# Altium schematic sheet DC-DC_BUCK-BOOST.SchDoc
size 1399 x 900 mm; SheetNumber: 1; SheetTotal: 1; SPICEModelCachePRJWMUZL: <root> / <DocumentId>PRJWMUZL</DocumentId> / <CacheFrame Number="0"> / <Model Name="7850_74477530_1m" Kind="CKT"> / <Text>******* / .subckt 7850_74477530_1m 1 2 / Rp 1 2 187304.915771 / Cp 1 2 4.36976277949p / Rs 1 N3 3.3 / L1 N3 2 1000u / .ends 7850_74477530_1m</Text> / </Model> / </CacheFrame> / </root>
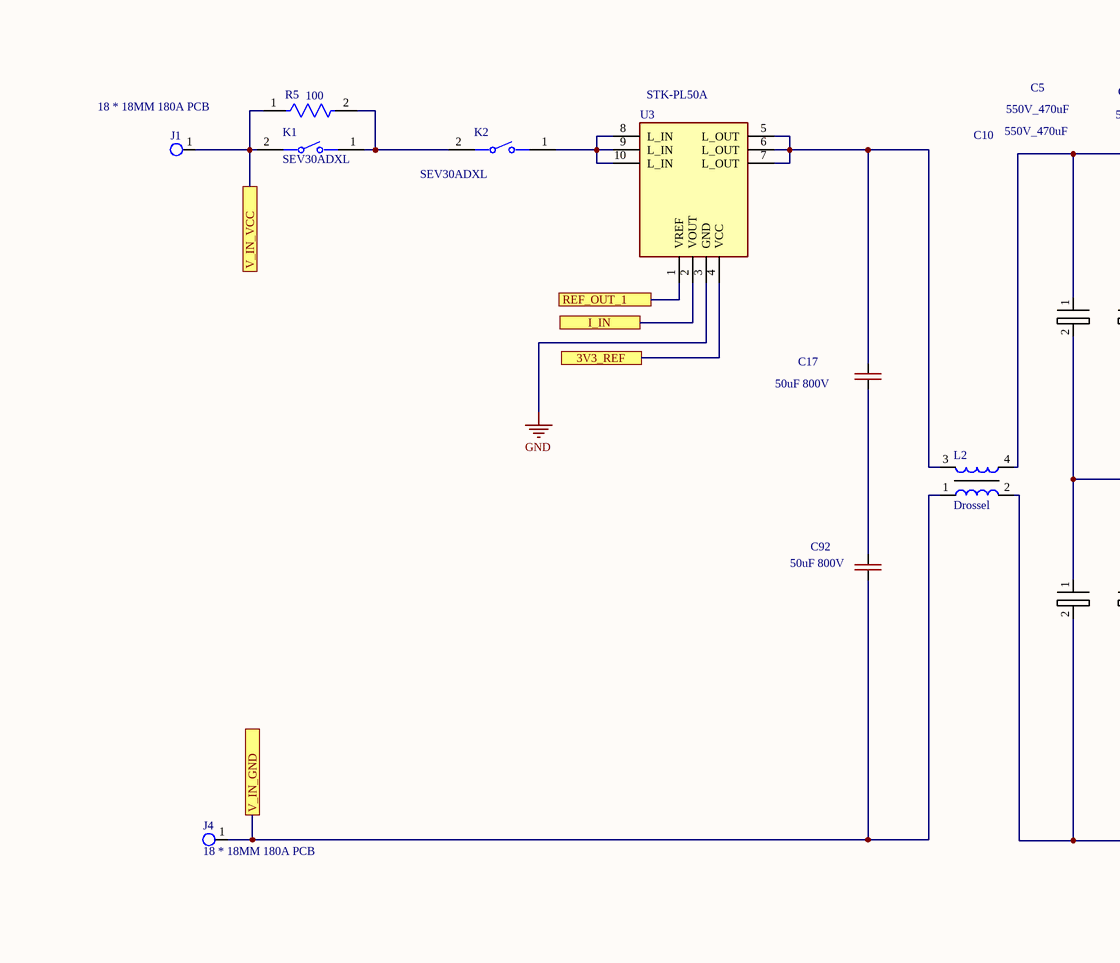
[diagram p0: DC-DC_BUCK-BOOST.SchDoc, top column 1 of 4]
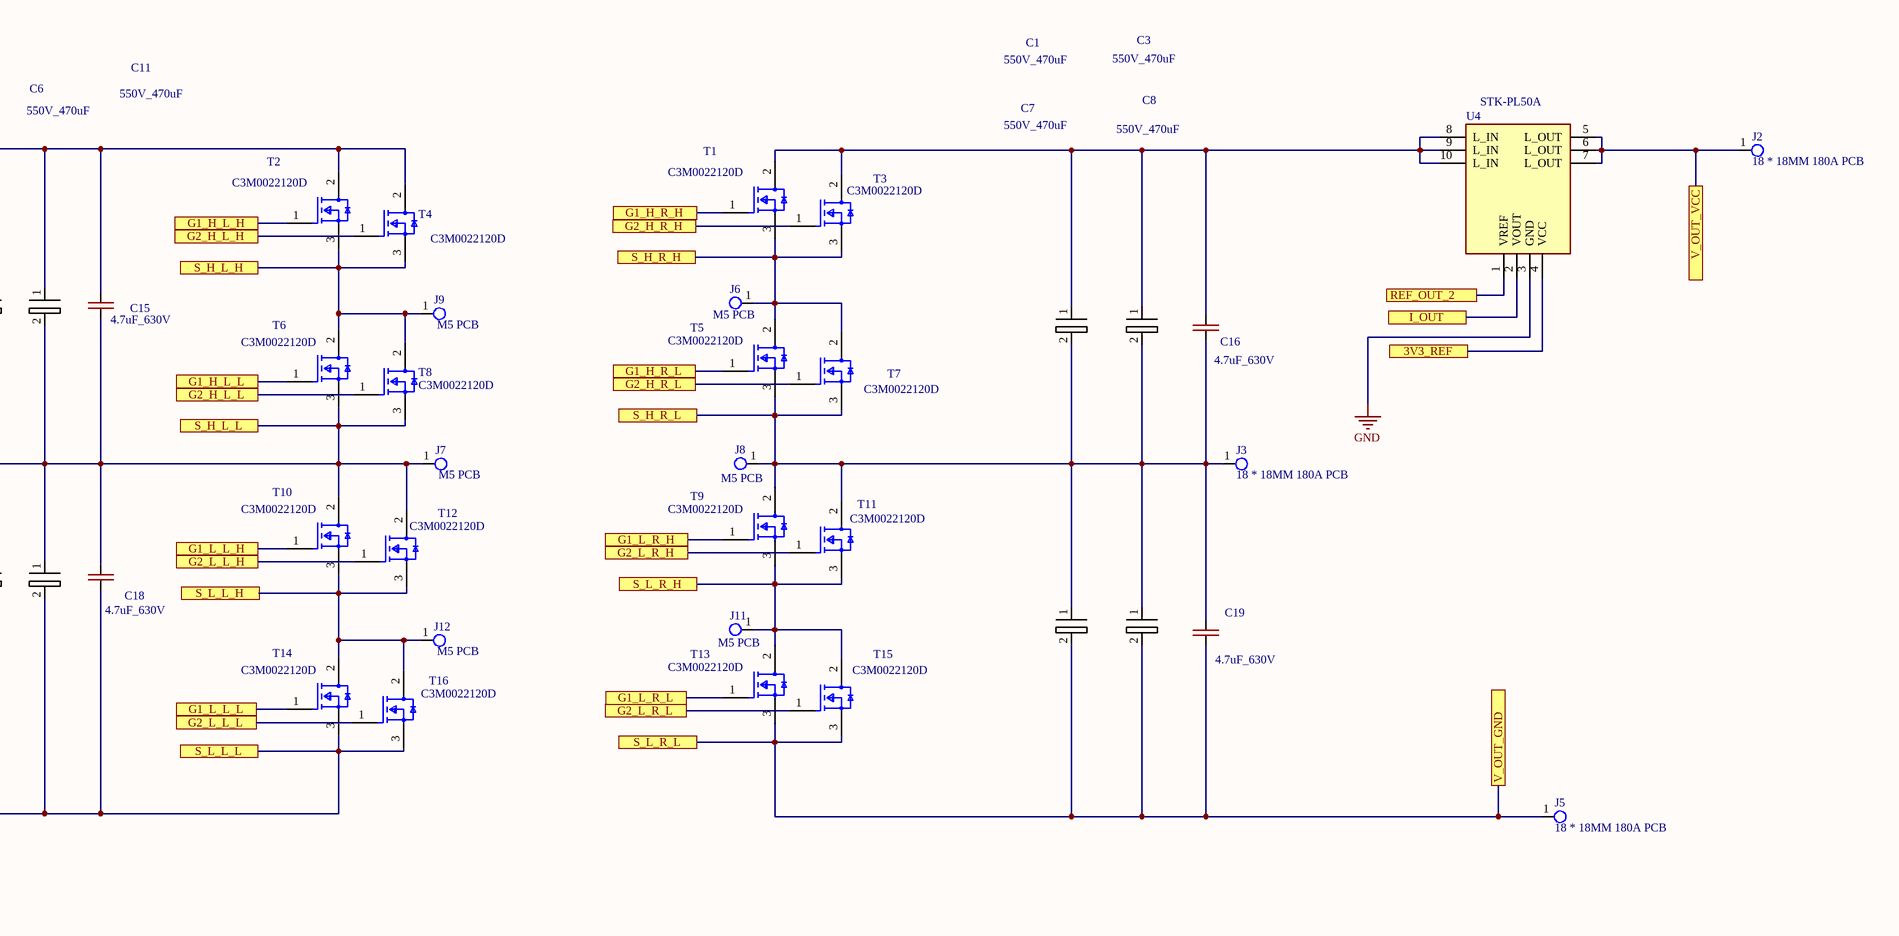
[diagram p1: DC-DC_BUCK-BOOST.SchDoc, top column 2 of 4]
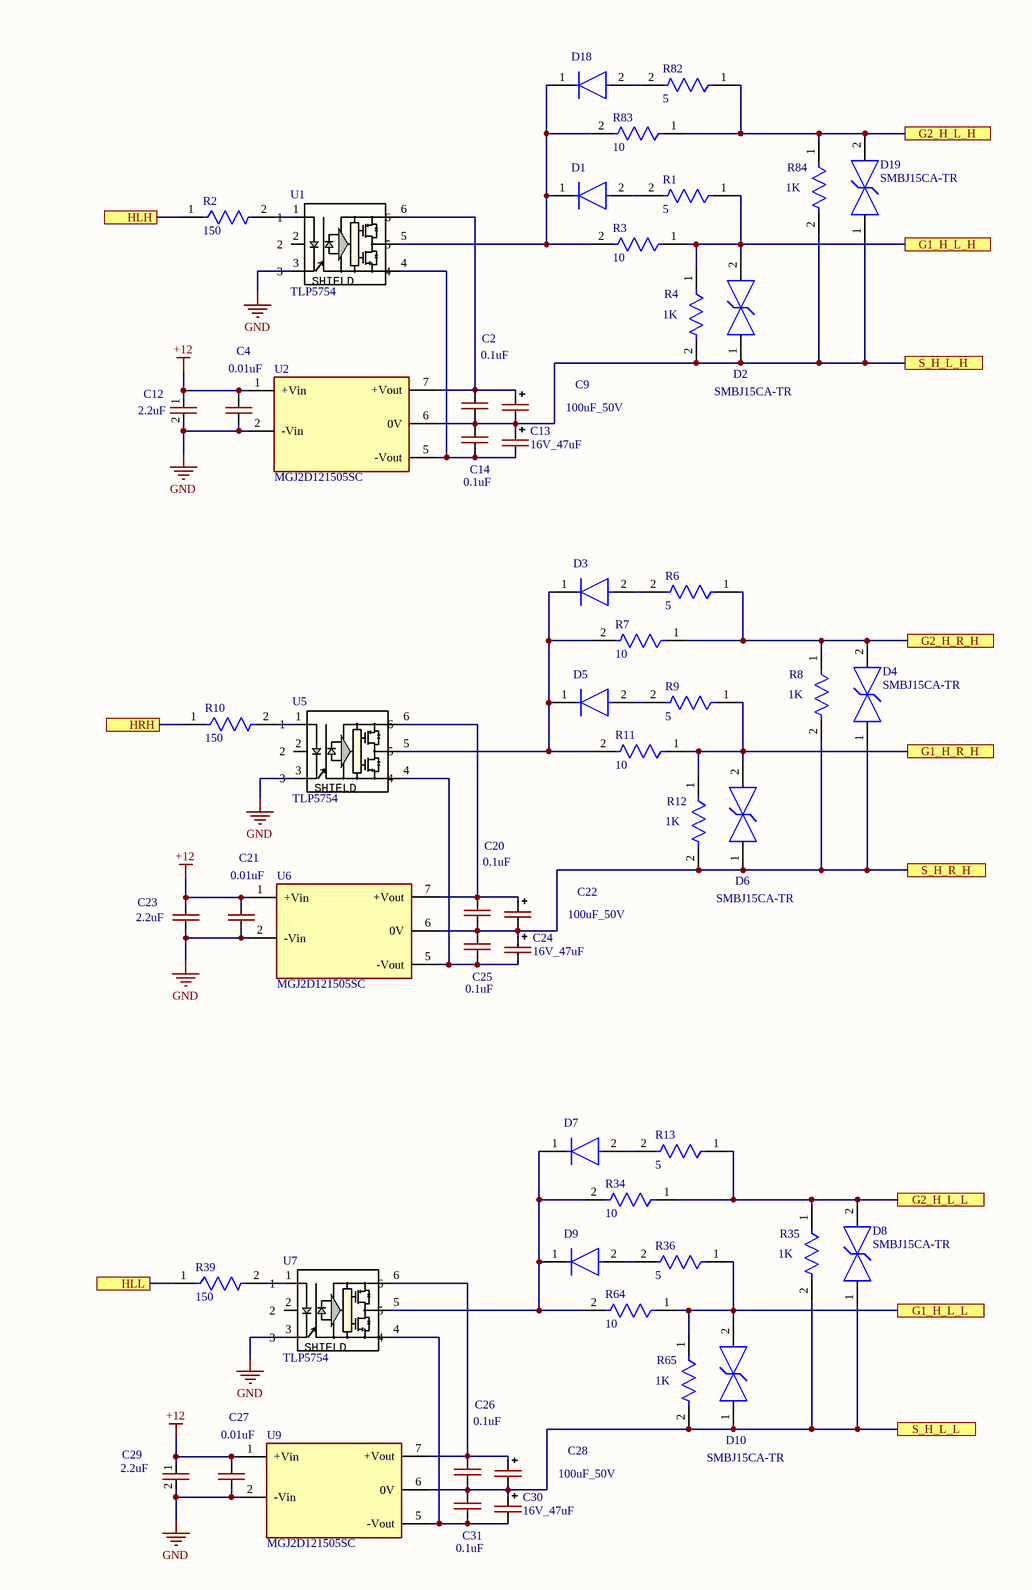
[diagram p2: DC-DC_BUCK-BOOST.SchDoc, top column 4 of 4]
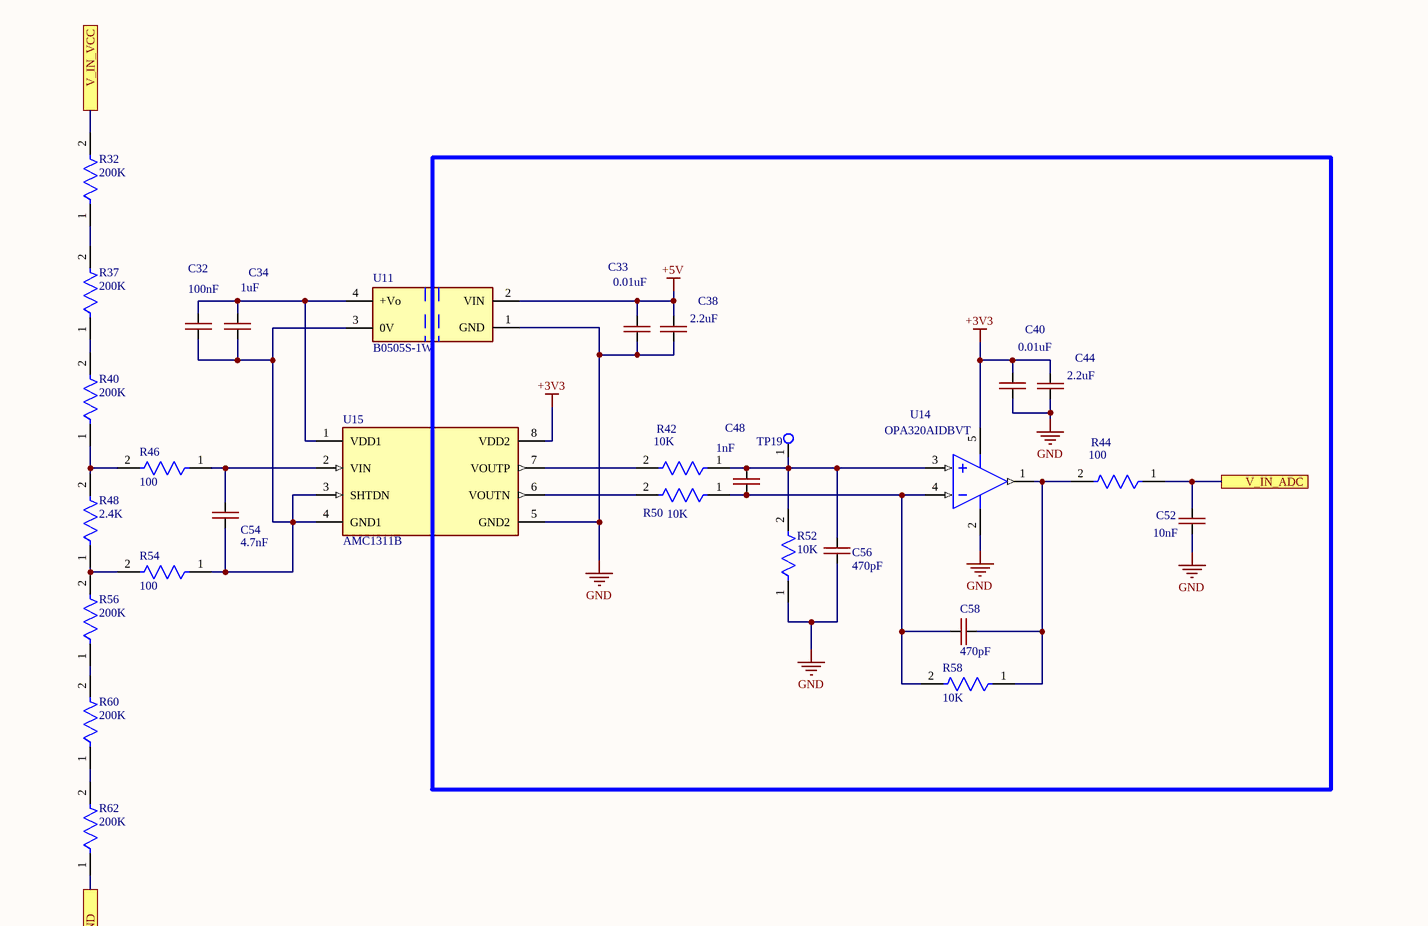
[diagram p3: DC-DC_BUCK-BOOST.SchDoc, centre column 1 of 4]
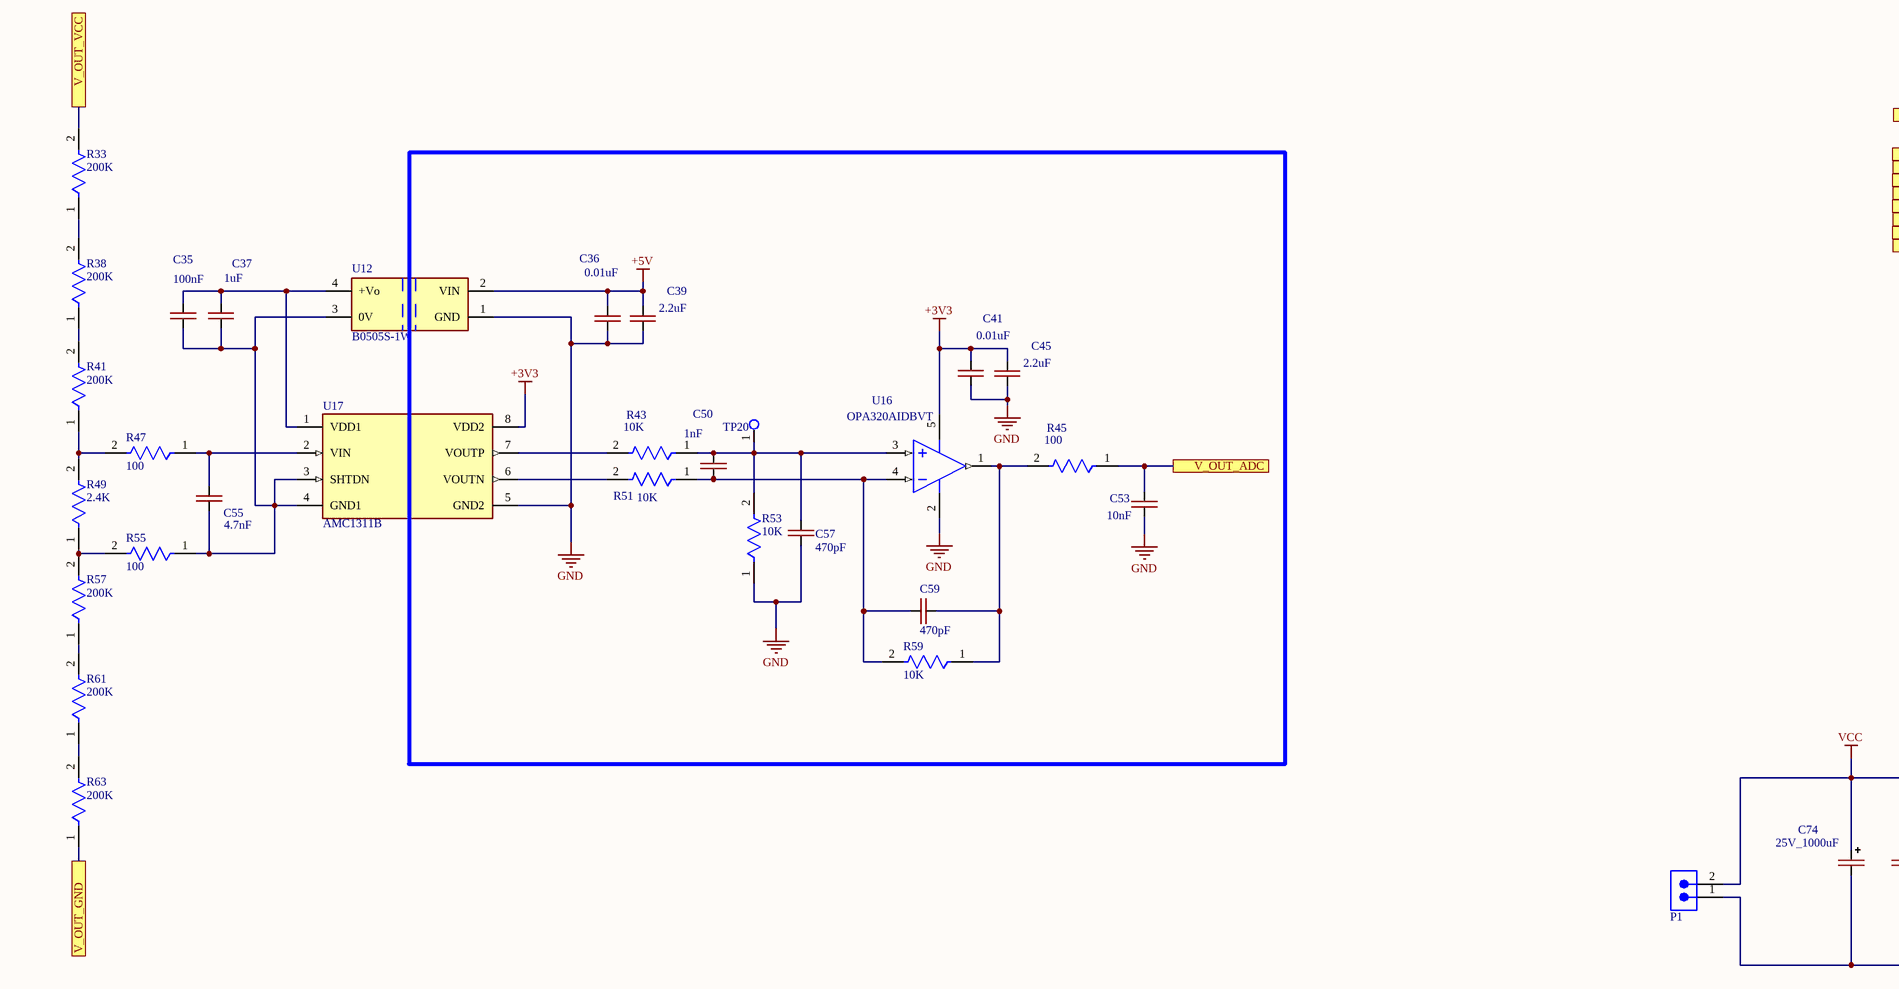
[diagram p4: DC-DC_BUCK-BOOST.SchDoc, centre column 2 of 4]
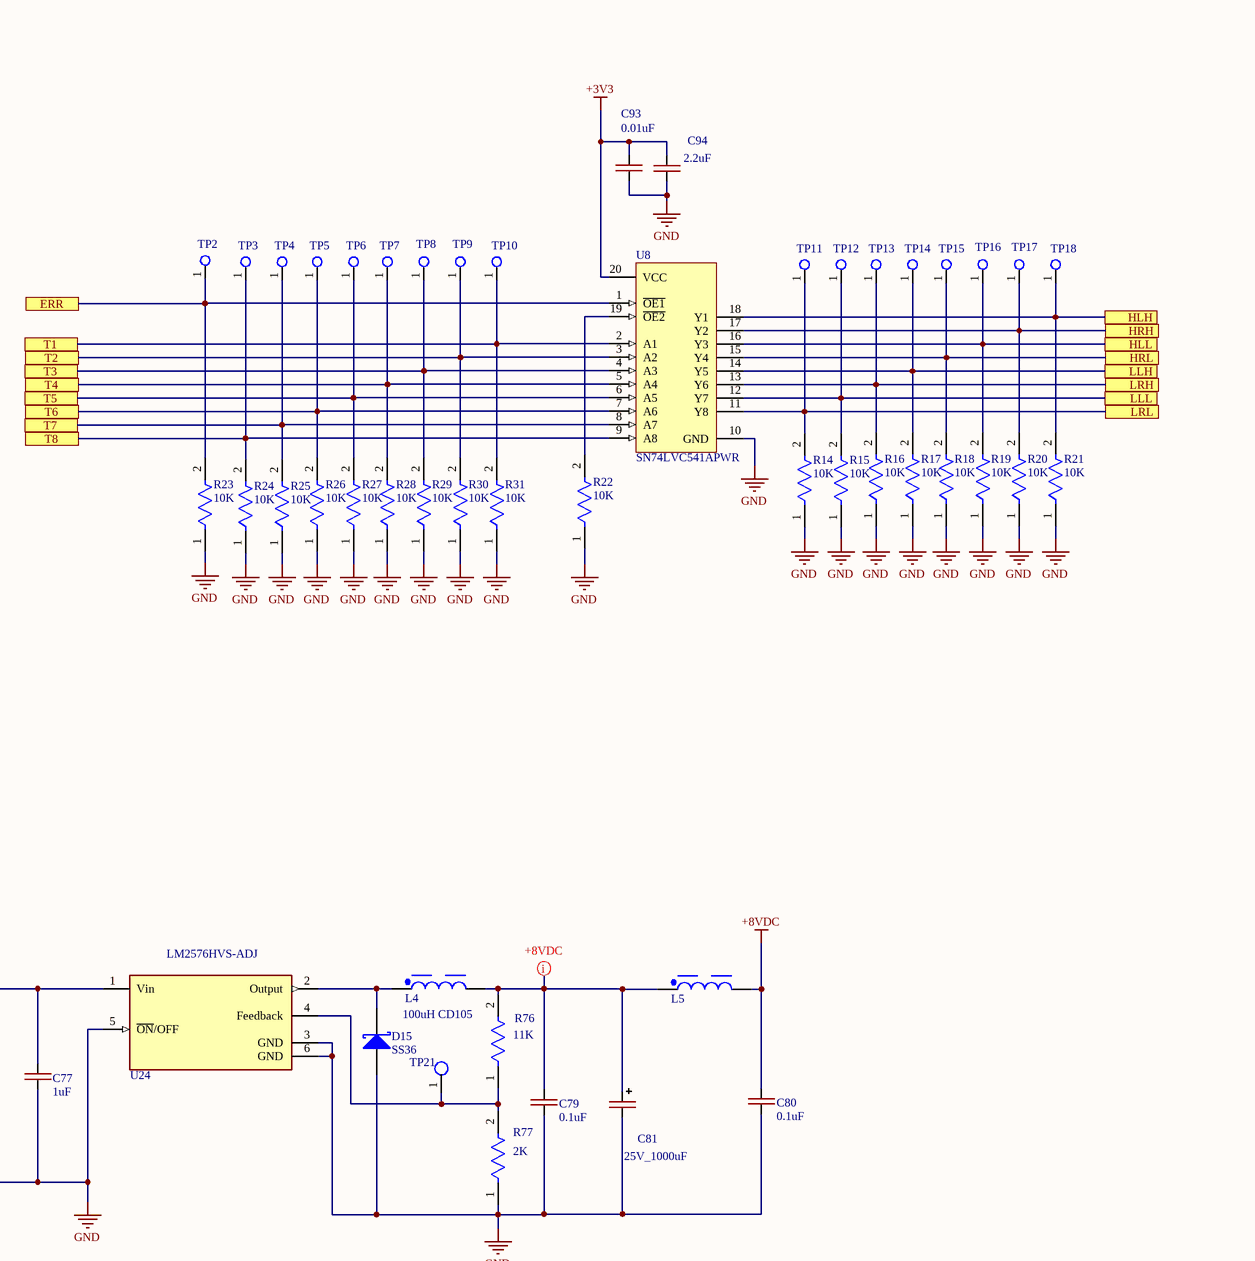
[diagram p5: DC-DC_BUCK-BOOST.SchDoc, centre column 3 of 4]
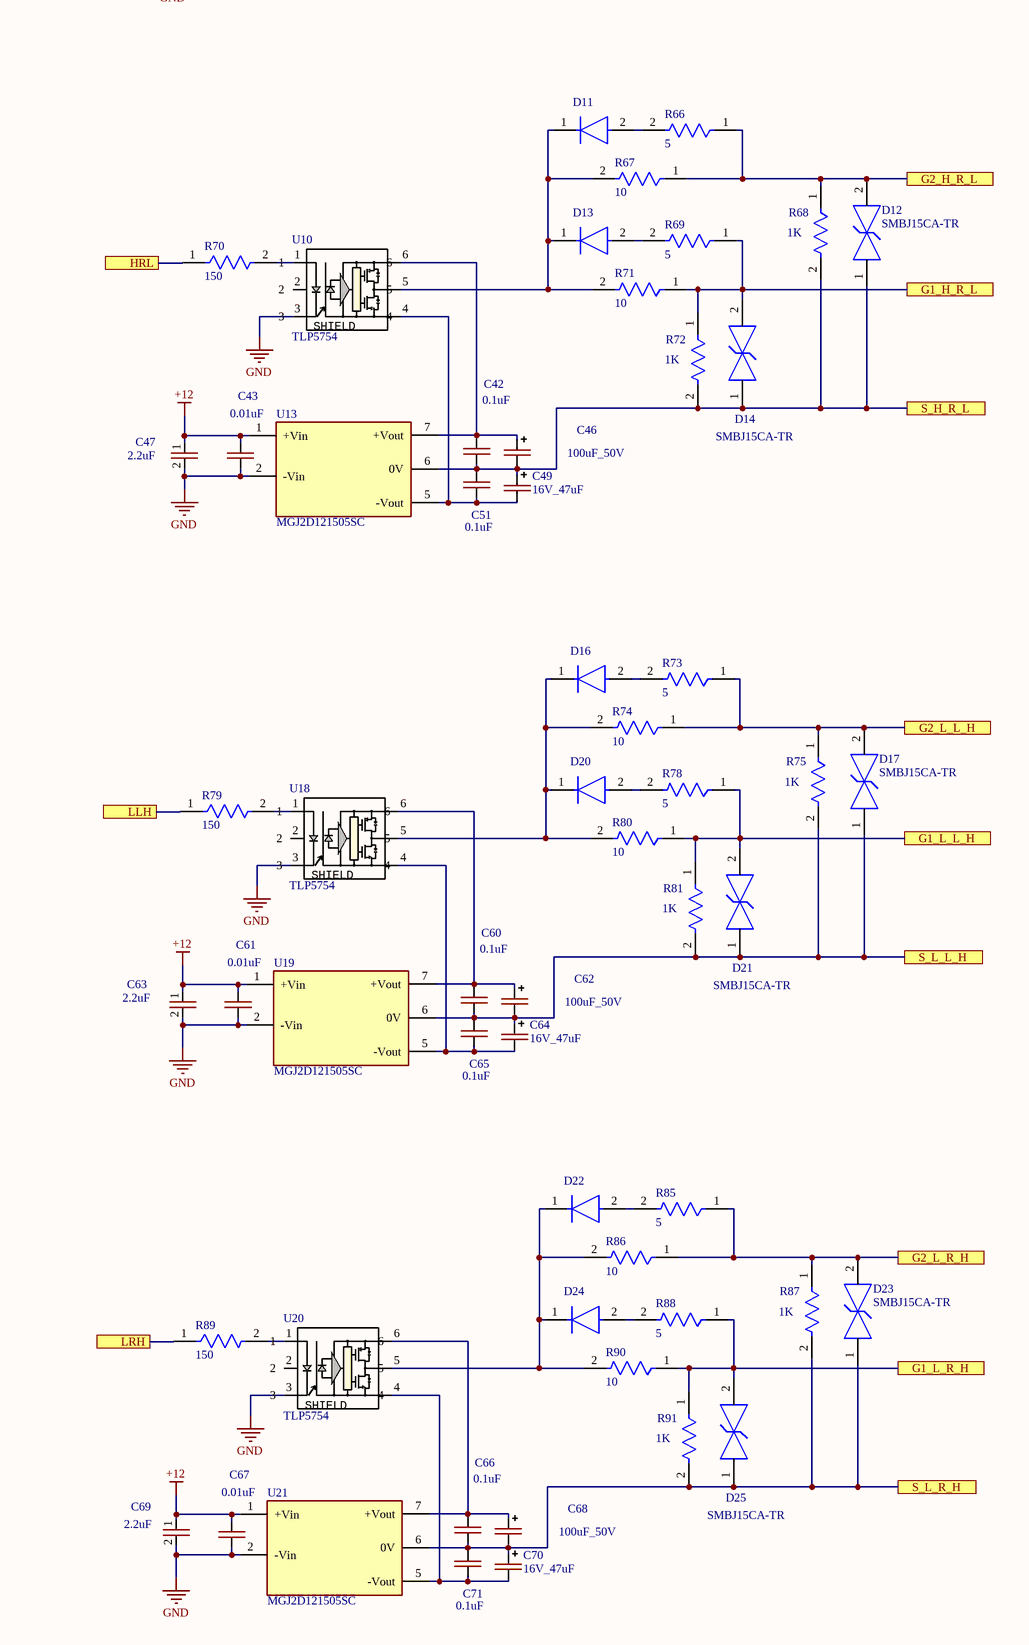
[diagram p6: DC-DC_BUCK-BOOST.SchDoc, centre column 4 of 4]
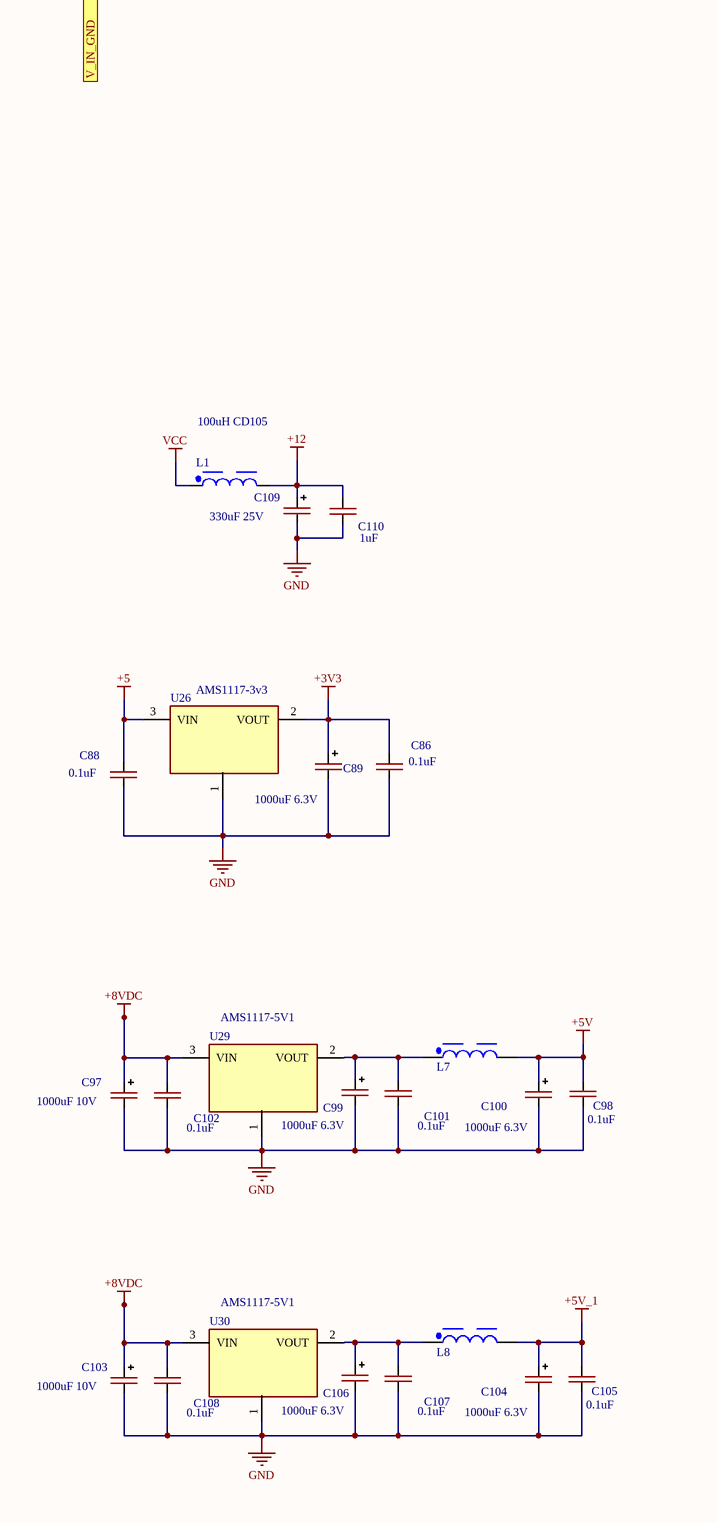
[diagram p7: DC-DC_BUCK-BOOST.SchDoc, bottom column 1 of 4]
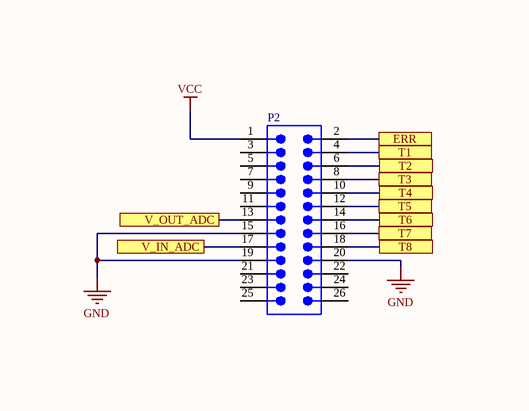
[diagram p8: DC-DC_BUCK-BOOST.SchDoc, bottom column 3 of 4]
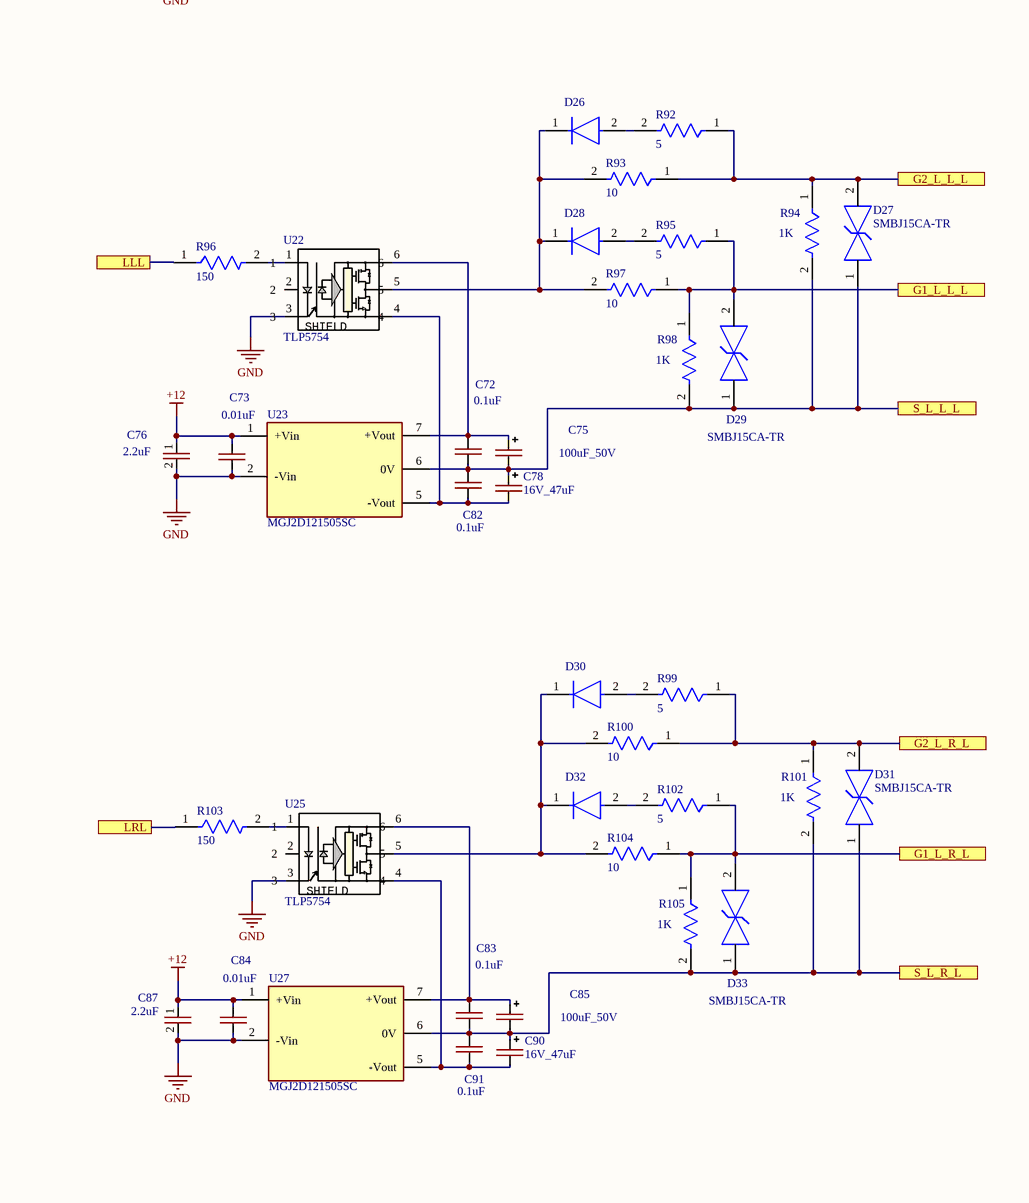
[diagram p9: DC-DC_BUCK-BOOST.SchDoc, bottom column 4 of 4]

## Parts
C1  550V_470uF  [500V_470uF]
C2  0.1uF  [CAP-0805]
C3  550V_470uF  [500V_470uF]
C4  0.01uF  [CAP-0805]
C5  550V_470uF  [500V_470uF]
C6  550V_470uF  [500V_470uF]
C7  550V_470uF  [500V_470uF]
C8  550V_470uF  [500V_470uF]
C9  100uF_50V  [CAP_SMD_Size_E]
C10  550V_470uF  [500V_470uF]
C11  550V_470uF  [500V_470uF]
C12  2.2uF  [CAP-0805]
C13  16V_47uF  [CAP-TAN-C]
C14  0.1uF  [CAP-0805]
C15  4.7uF_630V  [CAP_4.7uF_630V]
C16  4.7uF_630V  [CAP_4.7uF_630V]
C17  50uF 800V  [Z121578672 77G]
C18  4.7uF_630V  [CAP_4.7uF_630V]
C19  4.7uF_630V  [CAP_4.7uF_630V]
C20  0.1uF  [CAP-0805]
C21  0.01uF  [CAP-0805]
C22  100uF_50V  [CAP_SMD_Size_E]
C23  2.2uF  [CAP-0805]
C24  16V_47uF  [CAP-TAN-C]
C25  0.1uF  [CAP-0805]
C26  0.1uF  [CAP-0805]
C27  0.01uF  [CAP-0805]
C28  100uF_50V  [CAP_SMD_Size_E]
C29  2.2uF  [CAP-0805]
C30  16V_47uF  [CAP-TAN-C]
C31  0.1uF  [CAP-0805]
C32  100nF  [CAP-0603]
C33  0.01uF  [CAP-0603]
C34  1uF  [CAP-0603]
C35  100nF  [CAP-0603]
C36  0.01uF  [CAP-0603]
C37  1uF  [CAP-0603]
C38  2.2uF  [CAP-0603]
C39  2.2uF  [CAP-0603]
C40  0.01uF  [CAP-0603]
C41  0.01uF  [CAP-0603]
C42  0.1uF  [CAP-0805]
C43  0.01uF  [CAP-0805]
C44  2.2uF  [CAP-0603]
C45  2.2uF  [CAP-0603]
C46  100uF_50V  [CAP_SMD_Size_E]
C47  2.2uF  [CAP-0805]
C48  1nF  [CAP-0805]
C49  16V_47uF  [CAP-TAN-C]
C50  1nF  [CAP-0805]
C51  0.1uF  [CAP-0805]
C52  10nF  [CAP-0805]
C53  10nF  [CAP-0805]
C54  4.7nF  [CAP-0603]
C55  4.7nF  [CAP-0603]
C56  470pF  [CAP-0805]
C57  470pF  [CAP-0805]
C58  470pF  [CAP-0805]
C59  470pF  [CAP-0805]
C60  0.1uF  [CAP-0805]
C61  0.01uF  [CAP-0805]
C62  100uF_50V  [CAP_SMD_Size_E]
C63  2.2uF  [CAP-0805]
C64  16V_47uF  [CAP-TAN-C]
C65  0.1uF  [CAP-0805]
C66  0.1uF  [CAP-0805]
C67  0.01uF  [CAP-0805]
C68  100uF_50V  [CAP_SMD_Size_E]
C69  2.2uF  [CAP-0805]
C70  16V_47uF  [CAP-TAN-C]
C71  0.1uF  [CAP-0805]
C72  0.1uF  [CAP-0805]
C73  0.01uF  [CAP-0805]
C74  25V_1000uF  [HITANO 3300uF 25V  16x25]
C75  100uF_50V  [CAP_SMD_Size_E]
C76  2.2uF  [CAP-0805]
C77  1uF  [CAP-0805]
C78  16V_47uF  [CAP-TAN-C]
C79  0.1uF  [CAP-0805]
C80  0.1uF  [CAP-0805]
C81  25V_1000uF  [HITANO 3300uF 25V  16x25]
C82  0.1uF  [CAP-0805]
C83  0.1uF  [CAP-0805]
C84  0.01uF  [CAP-0805]
C85  100uF_50V  [CAP_SMD_Size_E]
C86  0.1uF  [CAP-0805]
C87  2.2uF  [CAP-0805]
C88  0.1uF  [CAP-0805]
C89  1000uF 6.3V  [CAP_SMD_Size_E]
C90  16V_47uF  [CAP-TAN-C]
C91  0.1uF  [CAP-0805]
C92  50uF 800V  [Z121578672 77G]
C93  0.01uF  [CAP-0603]
C94  2.2uF  [CAP-0603]
C97  1000uF 10V  [CAP_SMD_Size_G]
C98  0.1uF  [CAP-0805]
C99  1000uF 6.3V  [CAP_SMD_Size_E]
C100  1000uF 6.3V  [CAP_SMD_Size_E]
C101  0.1uF  [CAP-0805]
C102  0.1uF  [CAP-0805]
C103  1000uF 10V  [CAP_SMD_Size_G]
C104  1000uF 6.3V  [CAP_SMD_Size_E]
C105  0.1uF  [CAP-0805]
C106  1000uF 6.3V  [CAP_SMD_Size_E]
C107  0.1uF  [CAP-0805]
C108  0.1uF  [CAP-0805]
C109  330uF 25V  [CAP_SMD_Size_G]
C110  1uF  [CAP-0805]
D1  US1G  [US1G_SMA]  (value not drawn)
D2  SMBJ15CA-TR  [FP-SMB-CA-MFG]
D3  US1G  [US1G_SMA]  (value not drawn)
D4  SMBJ15CA-TR  [FP-SMB-CA-MFG]
D5  US1G  [US1G_SMA]  (value not drawn)
D6  SMBJ15CA-TR  [FP-SMB-CA-MFG]
D7  US1G  [US1G_SMA]  (value not drawn)
D8  SMBJ15CA-TR  [FP-SMB-CA-MFG]
D9  US1G  [US1G_SMA]  (value not drawn)
D10  SMBJ15CA-TR  [FP-SMB-CA-MFG]
D11  US1G  [US1G_SMA]  (value not drawn)
D12  SMBJ15CA-TR  [FP-SMB-CA-MFG]
D13  US1G  [US1G_SMA]  (value not drawn)
D14  SMBJ15CA-TR  [FP-SMB-CA-MFG]
D15  SS36  [SMC/DO214AB]
D16  US1G  [US1G_SMA]  (value not drawn)
D17  SMBJ15CA-TR  [FP-SMB-CA-MFG]
D18  US1G  [US1G_SMA]  (value not drawn)
D19  SMBJ15CA-TR  [FP-SMB-CA-MFG]
D20  US1G  [US1G_SMA]  (value not drawn)
D21  SMBJ15CA-TR  [FP-SMB-CA-MFG]
D22  US1G  [US1G_SMA]  (value not drawn)
D23  SMBJ15CA-TR  [FP-SMB-CA-MFG]
D24  US1G  [US1G_SMA]  (value not drawn)
D25  SMBJ15CA-TR  [FP-SMB-CA-MFG]
D26  US1G  [US1G_SMA]  (value not drawn)
D27  SMBJ15CA-TR  [FP-SMB-CA-MFG]
D28  US1G  [US1G_SMA]  (value not drawn)
D29  SMBJ15CA-TR  [FP-SMB-CA-MFG]
D30  US1G  [US1G_SMA]  (value not drawn)
D31  SMBJ15CA-TR  [FP-SMB-CA-MFG]
D32  US1G  [US1G_SMA]  (value not drawn)
D33  SMBJ15CA-TR  [FP-SMB-CA-MFG]
J1  18 * 18MM 180A PCB  [M8 Conn]
J2  18 * 18MM 180A PCB  [M8 Conn]
J3  18 * 18MM 180A PCB  [M8 Conn]
J4  18 * 18MM 180A PCB  [M8 Conn]
J5  18 * 18MM 180A PCB  [M8 Conn]
J6  M5 PCB  [M5_Conn]
J7  M5 PCB  [M5_Conn]
J8  M5 PCB  [M5_Conn]
J9  M5 PCB  [M5_Conn]
J11  M5 PCB  [M5_Conn]
J12  M5 PCB  [M5_Conn]
K1  SEV30ADXL  [Relay_1000VDC_30A]
K2  SEV30ADXL  [Relay_1000VDC_30A]
L1  100uH CD105  [WE-PD2_1054]
L2  Drossel  [T47x27x15]
L4  100uH CD105  [WE-PD2_1054]
L5  100uH CD105  [WE-PD2_1054]  (value not drawn)
L7  220uH CD75  [WE-PD2_7850]  (value not drawn)
L8  220uH CD75  [WE-PD2_7850]  (value not drawn)
P1  691305540002  [691305540002]  (value not drawn)
P2  61202621621  [61202621621]  (value not drawn)
R1  5  [RES-1206]
R2  150  [RES-0603]
R3  10  [RES-1206]
R4  1K  [RES-0805]
R5  100  [RES_100W_Aluminium]
R6  5  [RES-1206]
R7  10  [RES-1206]
R8  1K  [RES-0805]
R9  5  [RES-1206]
R10  150  [RES-0603]
R11  10  [RES-1206]
R12  1K  [RES-0805]
R13  5  [RES-1206]
R14  10K  [RES-0603]
R15  10K  [RES-0603]
R16  10K  [RES-0603]
R17  10K  [RES-0603]
R18  10K  [RES-0603]
R19  10K  [RES-0603]
R20  10K  [RES-0603]
R21  10K  [RES-0603]
R22  10K  [RES-0603]
R23  10K  [RES-0603]
R24  10K  [RES-0603]
R25  10K  [RES-0603]
R26  10K  [RES-0603]
R27  10K  [RES-0603]
R28  10K  [RES-0603]
R29  10K  [RES-0603]
R30  10K  [RES-0603]
R31  10K  [RES-0603]
R32  200K  [RES-1206]
R33  200K  [RES-1206]
R34  10  [RES-1206]
R35  1K  [RES-0805]
R36  5  [RES-1206]
R37  200K  [RES-1206]
R38  200K  [RES-1206]
R39  150  [RES-0603]
R40  200K  [RES-1206]
R41  200K  [RES-1206]
R42  10K  [RES-0603]
R43  10K  [RES-0603]
R44  100  [RES-0603]
R45  100  [RES-0603]
R46  100  [RES-0603]
R47  100  [RES-0603]
R48  2.4K  [RES-1206]
R49  2.4K  [RES-1206]
R50  10K  [RES-0603]
R51  10K  [RES-0603]
R52  10K  [RES-0805]
R53  10K  [RES-0805]
R54  100  [RES-0603]
R55  100  [RES-0603]
R56  200K  [RES-1206]
R57  200K  [RES-1206]
R58  10K  [RES-0805]
R59  10K  [RES-0805]
R60  200K  [RES-1206]
R61  200K  [RES-1206]
R62  200K  [RES-1206]
R63  200K  [RES-1206]
R64  10  [RES-1206]
R65  1K  [RES-0805]
R66  5  [RES-1206]
R67  10  [RES-1206]
R68  1K  [RES-0805]
R69  5  [RES-1206]
R70  150  [RES-0603]
R71  10  [RES-1206]
R72  1K  [RES-0805]
R73  5  [RES-1206]
R74  10  [RES-1206]
R75  1K  [RES-0805]
R76  11K  [RES-0805]
R77  2K  [RES-0805]
R78  5  [RES-1206]
R79  150  [RES-0603]
R80  10  [RES-1206]
R81  1K  [RES-0805]
R82  5  [RES-1206]
R83  10  [RES-1206]
R84  1K  [RES-0805]
R85  5  [RES-1206]
R86  10  [RES-1206]
R87  1K  [RES-0805]
R88  5  [RES-1206]
R89  150  [RES-0603]
R90  10  [RES-1206]
R91  1K  [RES-0805]
R92  5  [RES-1206]
R93  10  [RES-1206]
R94  1K  [RES-0805]
R95  5  [RES-1206]
R96  150  [RES-0603]
R97  10  [RES-1206]
R98  1K  [RES-0805]
R99  5  [RES-1206]
R100  10  [RES-1206]
R101  1K  [RES-0805]
R102  5  [RES-1206]
R103  150  [RES-0603]
R104  10  [RES-1206]
R105  1K  [RES-0805]
T1  C3M0022120D  [TO-247-3(BEND2)]
T2  C3M0022120D  [TO-247-3(BEND2)]
T3  C3M0022120D  [TO-247-3(BEND2)]
T4  C3M0022120D  [TO-247-3(BEND2)]
T5  C3M0022120D  [TO-247-3(BEND2)]
T6  C3M0022120D  [TO-247-3(BEND2)]
T7  C3M0022120D  [TO-247-3(BEND2)]
T8  C3M0022120D  [TO-247-3(BEND2)]
T9  C3M0022120D  [TO-247-3(BEND2)]
T10  C3M0022120D  [TO-247-3(BEND2)]
T11  C3M0022120D  [TO-247-3(BEND2)]
T12  C3M0022120D  [TO-247-3(BEND2)]
T13  C3M0022120D  [TO-247-3(BEND2)]
T14  C3M0022120D  [TO-247-3(BEND2)]
T15  C3M0022120D  [TO-247-3(BEND2)]
T16  C3M0022120D  [TO-247-3(BEND2)]
TP2  Test_Point_PCB  [Test_Point]  (value not drawn)
TP3  Test_Point_PCB  [Test_Point]  (value not drawn)
TP4  Test_Point_PCB  [Test_Point]  (value not drawn)
TP5  Test_Point_PCB  [Test_Point]  (value not drawn)
TP6  Test_Point_PCB  [Test_Point]  (value not drawn)
TP7  Test_Point_PCB  [Test_Point]  (value not drawn)
TP8  Test_Point_PCB  [Test_Point]  (value not drawn)
TP9  Test_Point_PCB  [Test_Point]  (value not drawn)
TP10  Test_Point_PCB  [Test_Point]  (value not drawn)
TP11  Test_Point_PCB  [Test_Point]  (value not drawn)
TP12  Test_Point_PCB  [Test_Point]  (value not drawn)
TP13  Test_Point_PCB  [Test_Point]  (value not drawn)
TP14  Test_Point_PCB  [Test_Point]  (value not drawn)
TP15  Test_Point_PCB  [Test_Point]  (value not drawn)
TP16  Test_Point_PCB  [Test_Point]  (value not drawn)
TP17  Test_Point_PCB  [Test_Point]  (value not drawn)
TP18  Test_Point_PCB  [Test_Point]  (value not drawn)
TP19  Test_Point_PCB  [Test_Point]  (value not drawn)
TP20  Test_Point_PCB  [Test_Point]  (value not drawn)
TP21  (no value)  [Test_Point]
U1  TLP5754  [SO6L_TOS]
U2  MGJ2D121505SC  [FP-MGJ2D121505SC-MFG]
U3  STK-PL50A  [STK-PL50A]
U4  STK-PL50A  [STK-PL50A]
U5  TLP5754  [SO6L_TOS]
U6  MGJ2D121505SC  [FP-MGJ2D121505SC-MFG]
U7  TLP5754  [SO6L_TOS]
U8  SN74LVC541APWR  [PW0020A_L]
U9  MGJ2D121505SC  [FP-MGJ2D121505SC-MFG]
U10  TLP5754  [SO6L_TOS]
U11  B0505S-1W  [B0505S-1W]
U12  B0505S-1W  [B0505S-1W]
U13  MGJ2D121505SC  [FP-MGJ2D121505SC-MFG]
U14  OPA320AIDBVT  [DBV0005A_M]
U15  AMC1311B  [FP-DWV0008A-MFG]
U16  OPA320AIDBVT  [DBV0005A_M]
U17  AMC1311B  [FP-DWV0008A-MFG]
U18  TLP5754  [SO6L_TOS]
U19  MGJ2D121505SC  [FP-MGJ2D121505SC-MFG]
U20  TLP5754  [SO6L_TOS]
U21  MGJ2D121505SC  [FP-MGJ2D121505SC-MFG]
U22  TLP5754  [SO6L_TOS]
U23  MGJ2D121505SC  [FP-MGJ2D121505SC-MFG]
U24  LM2576HVS-ADJ  [ON_Semiconductor_936A-02_MFG]
U25  TLP5754  [SO6L_TOS]
U26  AMS1117-3v3  [SOT-223-3]
U27  MGJ2D121505SC  [FP-MGJ2D121505SC-MFG]
U29  AMS1117-5V1  [SOT-223]
U30  AMS1117-5V1  [SOT-223]

## Ports
3V3_REF (see DC-DC_BUCK-BOOST[1A]), 3V3_REF (see DC-DC_BUCK-BOOST[3A]), ERR (see DC-DC_BUCK-BOOST[3B]), ERR (see DC-DC_BUCK-BOOST[4C]), G1_H_L_H (see DC-DC_BUCK-BOOST[2A]), G1_H_L_H (see DC-DC_BUCK-BOOST[6A]), G1_H_L_L (see DC-DC_BUCK-BOOST[2A]), G1_H_L_L (see DC-DC_BUCK-BOOST[6B]), G1_H_R_H (see DC-DC_BUCK-BOOST[2A]), G1_H_R_H (see DC-DC_BUCK-BOOST[6A]), G1_H_R_L (see DC-DC_BUCK-BOOST[2A]), G1_H_R_L (see DC-DC_BUCK-BOOST[6B]), G1_L_L_H (see DC-DC_BUCK-BOOST[2A]), G1_L_L_H (see DC-DC_BUCK-BOOST[6C]), G1_L_L_L (see DC-DC_BUCK-BOOST[2A]), G1_L_L_L (see DC-DC_BUCK-BOOST[6D]), G1_L_R_H (see DC-DC_BUCK-BOOST[2A]), G1_L_R_H (see DC-DC_BUCK-BOOST[6C]), G1_L_R_L (see DC-DC_BUCK-BOOST[2A]), G1_L_R_L (see DC-DC_BUCK-BOOST[6D]), G2_H_L_H (see DC-DC_BUCK-BOOST[2A]), G2_H_L_H (see DC-DC_BUCK-BOOST[6A]), G2_H_L_L (see DC-DC_BUCK-BOOST[2A]), G2_H_L_L (see DC-DC_BUCK-BOOST[6B]), G2_H_R_H (see DC-DC_BUCK-BOOST[2A]), G2_H_R_H (see DC-DC_BUCK-BOOST[6A]), G2_H_R_L (see DC-DC_BUCK-BOOST[2A]), G2_H_R_L (see DC-DC_BUCK-BOOST[6B]), G2_L_L_H (see DC-DC_BUCK-BOOST[2A]), G2_L_L_H (see DC-DC_BUCK-BOOST[6C]), G2_L_L_L (see DC-DC_BUCK-BOOST[2A]), G2_L_L_L (see DC-DC_BUCK-BOOST[6C]), G2_L_R_H (see DC-DC_BUCK-BOOST[2A]), G2_L_R_H (see DC-DC_BUCK-BOOST[6C]), G2_L_R_L (see DC-DC_BUCK-BOOST[2A]), G2_L_R_L (see DC-DC_BUCK-BOOST[6D]), HLH (see DC-DC_BUCK-BOOST[4B]), HLH (see DC-DC_BUCK-BOOST[6A]), HLL (see DC-DC_BUCK-BOOST[4C]), HLL (see DC-DC_BUCK-BOOST[6B]), HRH (see DC-DC_BUCK-BOOST[4C]), HRH (see DC-DC_BUCK-BOOST[6A]), HRL (see DC-DC_BUCK-BOOST[4C]), HRL (see DC-DC_BUCK-BOOST[6B]), I_IN, I_OUT, LLH (see DC-DC_BUCK-BOOST[4C]), LLH (see DC-DC_BUCK-BOOST[6C]), LLL (see DC-DC_BUCK-BOOST[4C]), LLL (see DC-DC_BUCK-BOOST[6D]), LRH (see DC-DC_BUCK-BOOST[4C]), LRH (see DC-DC_BUCK-BOOST[6C]), LRL (see DC-DC_BUCK-BOOST[4C]), LRL (see DC-DC_BUCK-BOOST[6D]), REF_OUT_1, REF_OUT_2, S_H_L_H (see DC-DC_BUCK-BOOST[2A]), S_H_L_H (see DC-DC_BUCK-BOOST[6A]), S_H_L_L (see DC-DC_BUCK-BOOST[2A]), S_H_L_L (see DC-DC_BUCK-BOOST[6B]), S_H_R_H (see DC-DC_BUCK-BOOST[2A]), S_H_R_H (see DC-DC_BUCK-BOOST[6A]), S_H_R_L (see DC-DC_BUCK-BOOST[2A]), S_H_R_L (see DC-DC_BUCK-BOOST[6B]), S_L_L_H (see DC-DC_BUCK-BOOST[2A]), S_L_L_H (see DC-DC_BUCK-BOOST[6C]), S_L_L_L (see DC-DC_BUCK-BOOST[2A]), S_L_L_L (see DC-DC_BUCK-BOOST[6D]), S_L_R_H (see DC-DC_BUCK-BOOST[2A]), S_L_R_H (see DC-DC_BUCK-BOOST[6C]), S_L_R_L (see DC-DC_BUCK-BOOST[2A]), S_L_R_L (see DC-DC_BUCK-BOOST[6D]), T1 (see DC-DC_BUCK-BOOST[3C]), T1 (see DC-DC_BUCK-BOOST[4C]), T2 (see DC-DC_BUCK-BOOST[3C]), T2 (see DC-DC_BUCK-BOOST[4C]), T3 (see DC-DC_BUCK-BOOST[3C]), T3 (see DC-DC_BUCK-BOOST[4C]), T4 (see DC-DC_BUCK-BOOST[3C]), T4 (see DC-DC_BUCK-BOOST[4D]), T5 (see DC-DC_BUCK-BOOST[3C]), T5 (see DC-DC_BUCK-BOOST[4D]), T6 (see DC-DC_BUCK-BOOST[3C]), T6 (see DC-DC_BUCK-BOOST[4D]), T7 (see DC-DC_BUCK-BOOST[3C]), T7 (see DC-DC_BUCK-BOOST[4D]), T8 (see DC-DC_BUCK-BOOST[3C]), T8 (see DC-DC_BUCK-BOOST[4D]), V_IN_ADC (see DC-DC_BUCK-BOOST[2C]), V_IN_ADC (see DC-DC_BUCK-BOOST[4D]), V_IN_GND (see DC-DC_BUCK-BOOST[1A]), V_IN_GND (see DC-DC_BUCK-BOOST[1C]), V_IN_VCC (see DC-DC_BUCK-BOOST[1A]), V_IN_VCC (see DC-DC_BUCK-BOOST[1B]), V_OUT_ADC (see DC-DC_BUCK-BOOST[3C]), V_OUT_ADC (see DC-DC_BUCK-BOOST[4D]), V_OUT_GND (see DC-DC_BUCK-BOOST[2C]), V_OUT_GND (see DC-DC_BUCK-BOOST[3A]), V_OUT_VCC (see DC-DC_BUCK-BOOST[2B]), V_OUT_VCC (see DC-DC_BUCK-BOOST[3A])

## Nets
+3V3: C40.2 C41.2 C44.2 C45.2 C86.2 C89.1(+) C93.2 C94.2 U8.20(VCC) U14.5(V+) U15.8(VDD2) U16.5(V+) U17.8(VDD2) U26.2(VOUT)
+5: C88.2 U26.3(VIN)
+5V: C33.2 C36.2 C38.2 C39.2 C98.2 C100.1(+) L7.2 U11.2(VIN) U12.2(VIN)
+5V_1: C104.1(+) C105.2 L8.2
+8VDC: C80.2 C97.1(+) C102.2 C103.1(+) C108.2 L5.2 U29.3(VIN) U30.3(VIN)
+12: C4.2 C12.1 C21.2 C23.2 C27.2 C29.1 C43.2 C47.1 C61.2 C63.1 C67.2 C69.1 C73.2 C76.1 C84.2 C87.1 C109.1(+) C110.2 L1.2 U2.1(+Vin) U6.1(+Vin) U9.1(+Vin) U13.1(+Vin) U19.1(+Vin) U21.1(+Vin) U23.1(+Vin) U27.1(+Vin)
GND: C4.1 C12.2 C21.1 C23.1 C27.1 C29.2 C33.1 C36.1 C38.1 C39.1 C40.1 C41.1 C43.1 C44.1 C45.1 C47.2 C52.1 C53.1 C56.1 C57.1 C61.1 C63.2 C67.1 C69.2 C73.1 C74.2(-) C76.2 C77.1 C79.1 C80.1 C81.2(-) C84.1 C86.1 C87.2 C88.1 C89.2(-) C93.1 C94.1 C97.2(-) C98.1 C99.2(-) C100.2(-) C101.1 C102.1 C103.2(-) C104.2(-) C105.1 C106.2(-) C107.1 C108.1 C109.2(-) C110.1 D15.2(A) P1.1 P2.15 P2.19 P2.20 R14.1 R15.1 R16.1 R17.1 R18.1 R19.1 R20.1 R21.1 R22.1 R23.1 R24.1 R25.1 R26.1 R27.1 R28.1 R29.1 R30.1 R31.1 R52.1 R53.1 R77.1 U1.3 U2.2(-Vin) U3.3(GND) U4.3(GND) U5.3 U6.2(-Vin) U7.3 U8.10(GND) U9.2(-Vin) U10.3 U11.1(GND) U12.1(GND) U13.2(-Vin) U14.2(V-) U15.5(GND2) U16.2(V-) U17.5(GND2) U18.3 U19.2(-Vin) U20.3 U21.2(-Vin) U22.3 U23.2(-Vin) U24.3(GND) U24.5(~{ON}/OFF) U24.6(GND) U25.3 U26.1(Ground) U27.2(-Vin) U29.1(Ground) U30.1(Ground)
VCC: C74.1(+) C77.2 L1.1 P1.2 P2.1 U24.1(Vin)
3V3_REF: U3.4(VCC) U4.4(VCC) ; port 3V3_REF
ERR: P2.2 R23.2 TP2.1(G9) U8.1(~{OE1}) ; port ERR
G1_H_L_H: D2.2 R1.1 R3.1 R4.1 T2.1(G) ; port G1_H_L_H
G1_H_L_L: D10.2 R36.1 R64.1 R65.1 T6.1(G) ; port G1_H_L_L
G1_H_R_H: D6.2 R9.1 R11.1 R12.1 T1.1(G) ; port G1_H_R_H
G1_H_R_L: D14.2 R69.1 R71.1 R72.1 T5.1(G) ; port G1_H_R_L
G1_L_L_H: D21.2 R78.1 R80.1 R81.1 T10.1(G) ; port G1_L_L_H
G1_L_L_L: D29.2 R95.1 R97.1 R98.1 T14.1(G) ; port G1_L_L_L
G1_L_R_H: D25.2 R88.1 R90.1 R91.1 T9.1(G) ; port G1_L_R_H
G1_L_R_L: D33.2 R102.1 R104.1 R105.1 T13.1(G) ; port G1_L_R_L
G2_H_L_H: D19.2 R82.1 R83.1 R84.1 T4.1(G) ; port G2_H_L_H
G2_H_L_L: D8.2 R13.1 R34.1 R35.1 T8.1(G) ; port G2_H_L_L
G2_H_R_H: D4.2 R6.1 R7.1 R8.1 T3.1(G) ; port G2_H_R_H
G2_H_R_L: D12.2 R66.1 R67.1 R68.1 T7.1(G) ; port G2_H_R_L
G2_L_L_H: D17.2 R73.1 R74.1 R75.1 T12.1(G) ; port G2_L_L_H
G2_L_L_L: D27.2 R92.1 R93.1 R94.1 T16.1(G) ; port G2_L_L_L
G2_L_R_H: D23.2 R85.1 R86.1 R87.1 T11.1(G) ; port G2_L_R_H
G2_L_R_L: D31.2 R99.1 R100.1 R101.1 T15.1(G) ; port G2_L_R_L
HLH: R2.1 R21.2 TP18.1(G9) U8.18(Y1) ; port HLH
HLL: R19.2 R39.1 TP16.1(G9) U8.16(Y3) ; port HLL
HRH: R10.1 R20.2 TP17.1(G9) U8.17(Y2) ; port HRH
HRL: R18.2 R70.1 TP15.1(G9) U8.15(Y4) ; port HRL
I_IN: U3.2(VOUT) ; port I_IN
I_OUT: U4.2(VOUT) ; port I_OUT
LLH: R17.2 R79.1 TP14.1(G9) U8.14(Y5) ; port LLH
LLL: R15.2 R96.1 TP12.1(G9) U8.12(Y7) ; port LLL
LRH: R16.2 R89.1 TP13.1(G9) U8.13(Y6) ; port LRH
LRL: R14.2 R103.1 TP11.1(G9) U8.11(Y8) ; port LRL
REF_OUT_1: U3.1(VREF) ; port REF_OUT_1
REF_OUT_2: U4.1(VREF) ; port REF_OUT_2
S_H_L_H: C2.1 C9.2(-) C13.1(+) C14.2 D2.1 D19.1 J9.1 R4.2 R84.2 T2.3(S) T4.3(S) T6.2(D) T8.2(D) U2.6(0V) ; port S_H_L_H
S_H_L_L: C5.2 C6.1 C10.2 C11.1 C15.1 C18.2 C26.1 C28.2(-) C30.1(+) C31.2 D8.1 D10.1 J7.1 R35.2 R65.2 T6.3(S) T8.3(S) T10.2(D) T12.2(D) U9.6(0V) ; port S_H_L_L
S_H_R_H: C20.1 C22.2(-) C24.1(+) C25.2 D4.1 D6.1 J6.1 R8.2 R12.2 T1.3(S) T3.3(S) T5.2(D) T7.2(D) U6.6(0V) ; port S_H_R_H
S_H_R_L: C1.1 C3.1 C7.2 C8.2 C16.1 C19.2 C42.1 C46.2(-) C49.1(+) C51.2 D12.1 D14.1 J3.1 J8.1 R68.2 R72.2 T5.3(S) T7.3(S) T9.2(D) T11.2(D) U13.6(0V) ; port S_H_R_L
S_L_L_H: C60.1 C62.2(-) C64.1(+) C65.2 D17.1 D21.1 J12.1 R75.2 R81.2 T10.3(S) T12.3(S) T14.2(D) T16.2(D) U19.6(0V) ; port S_L_L_H
S_L_L_L: C6.2 C11.2 C18.1 C72.1 C75.2(-) C78.1(+) C82.2 D27.1 D29.1 L2.2 R94.2 R98.2 T14.3(S) T16.3(S) U23.6(0V) ; port S_L_L_L
S_L_R_H: C66.1 C68.2(-) C70.1(+) C71.2 D23.1 D25.1 J11.1 R87.2 R91.2 T9.3(S) T11.3(S) T13.2(D) T15.2(D) U21.6(0V) ; port S_L_R_H
S_L_R_L: C1.2 C3.2 C19.1 C83.1 C85.2(-) C90.1(+) C91.2 D31.1 D33.1 J5.1 R63.1 R101.2 R105.2 T13.3(S) T15.3(S) U27.6(0V) ; port S_L_R_L, port V_OUT_GND
T1: P2.4 R31.2 TP10.1(G9) U8.2(A1) ; port T1
T2: P2.6 R30.2 TP9.1(G9) U8.3(A2) ; port T2
T3: P2.8 R29.2 TP8.1(G9) U8.4(A3) ; port T3
T4: P2.10 R28.2 TP7.1(G9) U8.5(A4) ; port T4
T5: P2.12 R27.2 TP6.1(G9) U8.6(A5) ; port T5
T6: P2.14 R26.2 TP5.1(G9) U8.7(A6) ; port T6
T7: P2.16 R25.2 TP4.1(G9) U8.8(A7) ; port T7
T8: P2.18 R24.2 TP3.1(G9) U8.9(A8) ; port T8
V_IN_ADC: C52.2 P2.17 R44.1 ; port V_IN_ADC
V_IN_GND: C92.1 J4.1 L2.1 R62.1 ; port V_IN_GND
V_IN_VCC: J1.1 K1.2 R5.1 R32.2 ; port V_IN_VCC
V_OUT_ADC: C53.2 P2.13 R45.1 ; port V_OUT_ADC
V_OUT_VCC: J2.1 R33.2 U4.5(L_OUT) U4.6(L_OUT) U4.7(L_OUT) ; port V_OUT_VCC
NetC2_2: C2.2 C9.1(+) U1.6 U2.7(+Vout)
NetC5_1: C5.1 C10.1 C15.2 L2.4 T2.2(D) T4.2(D)
NetC7_1: C7.1 C8.1 C16.2 T1.2(D) T3.2(D) U4.8(L_IN) U4.9(L_IN) U4.10(L_IN)
NetC13_2: C13.2(-) C14.1 U1.4 U2.5(-Vout)
NetC17_1: C17.1 C92.2
NetC17_2: C17.2 L2.3 U3.5(L_OUT) U3.6(L_OUT) U3.7(L_OUT)
NetC20_2: C20.2 C22.1(+) U5.6 U6.7(+Vout)
NetC24_2: C24.2(-) C25.1 U5.4 U6.5(-Vout)
NetC26_2: C26.2 C28.1(+) U7.6 U9.7(+Vout)
NetC30_2: C30.2(-) C31.1 U7.4 U9.5(-Vout)
NetC32_1: C32.1 C34.1 C54.1 R54.1 U11.3(0V) U15.3(SHTDN) U15.4(GND1)
NetC32_2: C32.2 C34.2 U11.4(+Vo) U15.1(VDD1)
NetC35_1: C35.1 C37.1 C55.1 R55.1 U12.3(0V) U17.3(SHTDN) U17.4(GND1)
NetC35_2: C35.2 C37.2 U12.4(+Vo) U17.1(VDD1)
NetC42_2: C42.2 C46.1(+) U10.6 U13.7(+Vout)
NetC48_1: C48.1 C58.2 R50.1 R58.2 U14.4(IN-)
NetC48_2: C48.2 C56.2 R42.1 R52.2 TP19.1(G9) U14.3(IN+)
NetC49_2: C49.2(-) C51.1 U10.4 U13.5(-Vout)
NetC50_1: C50.1 C59.2 R51.1 R59.2 U16.4(IN-)
NetC50_2: C50.2 C57.2 R43.1 R53.2 TP20.1(G9) U16.3(IN+)
NetC54_2: C54.2 R46.1 U15.2(VIN)
NetC55_2: C55.2 R47.1 U17.2(VIN)
NetC58_1: C58.1 R44.2 R58.1 U14.1(OUT)
NetC59_1: C59.1 R45.2 R59.1 U16.1(OUT)
NetC60_2: C60.2 C62.1(+) U18.6 U19.7(+Vout)
NetC64_2: C64.2(-) C65.1 U18.4 U19.5(-Vout)
NetC66_2: C66.2 C68.1(+) U20.6 U21.7(+Vout)
NetC70_2: C70.2(-) C71.1 U20.4 U21.5(-Vout)
NetC72_2: C72.2 C75.1(+) U22.6 U23.7(+Vout)
NetC78_2: C78.2(-) C82.1 U22.4 U23.5(-Vout)
NetC79_2: C79.2 C81.1(+) L4.2 L5.1 R76.2
NetC83_2: C83.2 C85.1(+) U25.6 U27.7(+Vout)
NetC90_2: C90.2(-) C91.1 U25.4 U27.5(-Vout)
NetC99_1: C99.1(+) C101.2 L7.1 U29.2(VOUT)
NetC106_1: C106.1(+) C107.2 L8.1 U30.2(VOUT)
NetD1_1: D1.1(C) D18.1(C) R3.2 R83.2 U1.5
NetD1_2: D1.2(A) R1.2
NetD3_1: D3.1(C) D5.1(C) R7.2 R11.2 U5.5
NetD3_2: D3.2(A) R6.2
NetD5_2: D5.2(A) R9.2
NetD7_1: D7.1(C) D9.1(C) R34.2 R64.2 U7.5
NetD7_2: D7.2(A) R13.2
NetD9_2: D9.2(A) R36.2
NetD11_1: D11.1(C) D13.1(C) R67.2 R71.2 U10.5
NetD11_2: D11.2(A) R66.2
NetD13_2: D13.2(A) R69.2
NetD15_1: D15.1(K) L4.1 U24.2(Output)
NetD16_1: D16.1(C) D20.1(C) R74.2 R80.2 U18.5
NetD16_2: D16.2(A) R73.2
NetD18_2: D18.2(A) R82.2
NetD20_2: D20.2(A) R78.2
NetD22_1: D22.1(C) D24.1(C) R86.2 R90.2 U20.5
NetD22_2: D22.2(A) R85.2
NetD24_2: D24.2(A) R88.2
NetD26_1: D26.1(C) D28.1(C) R93.2 R97.2 U22.5
NetD26_2: D26.2(A) R92.2
NetD28_2: D28.2(A) R95.2
NetD30_1: D30.1(C) D32.1(C) R100.2 R104.2 U25.5
NetD30_2: D30.2(A) R99.2
NetD32_2: D32.2(A) R102.2
NetK1_1: K1.1 K2.2 R5.2
NetK2_1: K2.1 U3.8(L_IN) U3.9(L_IN) U3.10(L_IN)
NetR2_2: R2.2 U1.1
NetR10_2: R10.2 U5.1
NetR22_2: R22.2 U8.19(~{OE2})
NetR32_1: R32.1 R37.2
NetR33_1: R33.1 R38.2
NetR37_1: R37.1 R40.2
NetR38_1: R38.1 R41.2
NetR39_2: R39.2 U7.1
NetR40_1: R40.1 R46.2 R48.2
NetR41_1: R41.1 R47.2 R49.2
NetR42_2: R42.2 U15.7(VOUTP)
NetR43_2: R43.2 U17.7(VOUTP)
NetR48_1: R48.1 R54.2 R56.2
NetR49_1: R49.1 R55.2 R57.2
NetR50_2: R50.2 U15.6(VOUTN)
NetR51_2: R51.2 U17.6(VOUTN)
NetR56_1: R56.1 R60.2
NetR57_1: R57.1 R61.2
NetR60_1: R60.1 R62.2
NetR61_1: R61.1 R63.2
NetR70_2: R70.2 U10.1
NetR76_1: R76.1 R77.2 TP21.1(G9) U24.4(Feedback)
NetR79_2: R79.2 U18.1
NetR89_2: R89.2 U20.1
NetR96_2: R96.2 U22.1
NetR103_2: R103.2 U25.1

Not connected (* = marked no-connect by the designer): P2 3 5 7 9 11 21 22 23 24 25 26; U1 2; U5 2; U7 2; U10 2; U18 2; U20 2; U22 2; U25 2

## Layout directives
mark named +8VDC: NetC79_2

## Notes on the sheet
- (in symbol TLP5754) SHIELD

## Library data of the parts
C1 C3 C5-C8 C10 C11 = CAP_POL_LOW_IMP
C2 C14 C20 C25 C26 C31 C42 C51 C60 C65 C66 C71 C72 C82 C83 C91 = CAP-NON-POLAR: 0.1uF X7R
C4 C21 C27 C43 C61 C67 C73 C84 = CAP-NON-POLAR: 0.01uF X7R
C9 C13 C22 C24 C28 C30 C46 C49 C62 C64 C68 C70 C75 C78 C85 C90 = CAP_POL_SMD
C12 C16-C19 C23 C29 C32-C41 C44 C45 C47 C48 C50 C52-C59 C63 C69 C76 C77 C79 C80 C86-C88 C92-C94 C98 C101 C102 C105 C107 C108 C110 = CAP-NON-POLAR
C15 = CAP-NON-POLAR: 4.7uF_630V   CBB21
C74 C81 C89 C97 C99 C100 C103 C104 C106 C109 = CAP-POLAR
D15 = SS36_Schottky
J1-J5 = Klema_15_A: 18 * 18MM 180A PCB High Current Solder Terminal Copper Terminal Fastener M8 Nut
J6-J9 J11 J12 = Klema_15_A
K1 K2 = Relay: 5-1000V 30A DC Contactor Power Relay SEV30ADXL Coil 12V
L1 = CMP-0227-00501-2: NexarPartId: 24533346; Inductance: 270µH; Current Rating: 620mA; Self Resonant Frequency: 4MHz; DC Resistance (DCR): 500mΩ; Ambient Temperature Range Low: -40°C; Min Operating Temperature: -40°C; RoHS: Compliant; Ambient Temperature Range High: 85°C; Packaging: Digi-Reel®; Height: 5.4mm; Length: 9mm; Max Operating Temperature: 125°C; Width: 10mm
L2 = Drossel_Synphaze
L4 L5 = 744776122: Manufacturer: Wurth Elektronik; Match Code: WE-PD2; Case/Size Code: 1054; DC Resistance: 0.051Ω; DC Resistance Max: 0.1Ω; Inductance: 22µH; Rated Current: 2.04A; Saturation Current: 2.07A; Self Resonant Frequency: 16MHz; Manufacturer Part Number: 744776122; Category: Unshielded Power Inductors; ComponentLink1Description: Website Link; ComponentLink1URL: https://www.we-online.com/redexpert/article/744776122?ad; ComponentLink2Description: Datasheet Link; ComponentLink2URL: https://www.we-online.com/redexpert/spec/744776122?ad; Mount: Surface Mount; Operating Temperature Max: 125°C; Operating Temperature Min: -40°C; Packaging: Tape and Reel; Length: 10mm; Width: 9mm; Height: 5.4mm
L7 L8 = 74477530: Manufacturer: Wurth Elektronik; Match Code: WE-PD2; Case/Size Code: 7850; DC Resistance: 2.78Ω; DC Resistance Max: 3.3Ω; Inductance: 1000µH; Rated Current: 0.3A; Self Resonant Frequency: 2.4MHz; Manufacturer Part Number: 74477530; Category: Unshielded Power Inductors; ComponentLink1Description: Website Link; ComponentLink1URL: https://www.we-online.com/redexpert/article/74477530?ad; ComponentLink2Description: Datasheet Link; ComponentLink2URL: https://www.we-online.com/redexpert/spec/74477530?ad; Mount: Surface Mount; Operating Temperature Max: 125°C; Operating Temperature Min: -40°C; Packaging: Tape and Reel; Length: 7.8mm; Width: 7mm; Height: 4.95mm; Saturation Current: 0.3A
P1 = 691305540002: WR-TBL Series 3055 PCB Header Horizontal Entry with Plastic Latches, THT, pitch 5.08mm, 2p; Manufacturer: Wurth Elektronik; Modularity: No; Rated Current: 16A; Working Voltage: 300V; ComponentLink1Description: Website Link; ComponentLink1URL: https://www.we-online.com/redexpert/article/691305540002?ad; ComponentLink2Description: Datasheet Link; ComponentLink2URL: https://www.we-online.com/redexpert/spec/691305540002?ad; Manufacturer Part Number: 691305540002; Category: Terminal Blocks; Match Code: WR-TBL; Mount: Through Hole; Operating Temperature Max: 105°C; Operating Temperature Min: -40°C; Packaging: Box; Application: Pluggable; Number of Pins: 2; Number of Rows: 1; Orientation: Horizontal; Pitch: 5.08mm
P2 = 61202621621: WR-BHD Male Box Header, THT Straight, pitch 2.54 mm, 2 Rows, 26 Pins; Manufacturer: Wurth Elektronik; Contact Resistance: 20 mΩ; Insulation Resistance: 1000 MΩ; Pitch: 2.54 mm; Rated Current: 3 A; Working Voltage: 250 V; Withstanding Voltage: 500 V; Manufacturer Part Number: 61202621621; Category: Wire-to-Board Connector; Connectors.Match Code: WR-BHD; ComponentLink1Description: Website Link; ComponentLink1URL: https://www.we-online.com/redexpert/article/61202621621?ad; ComponentLink2Description: Datasheet Link; ComponentLink2URL: https://www.we-online.com/redexpert/spec/61202621621?ad; Mount: Through Hole; Min Operating Temperature: -40 °C; Max Operating Temperature: 105 °C; Packaging: Tray; Length: 40.68 mm; Width: 9.1 mm; Height: 9.1 mm; Gender: Male; Number of Pins: 26; Number of Rows: 2; Orientation: Straight
R1-R4 R6-R105 = RES-CONST
R5 = RES-CONST: 100W RX24 Aluminum Power Metal Shell Case Wirewound Resistor 100Omh
TP2-TP21 = TP_PCB?: Test_Point
U15 U17 = AMC1311
U24 = LM2576D2T-005G
U26 U29 U30 = AMS1117